# EAGLE design pi_rgb (EAGLE 7.1.0)
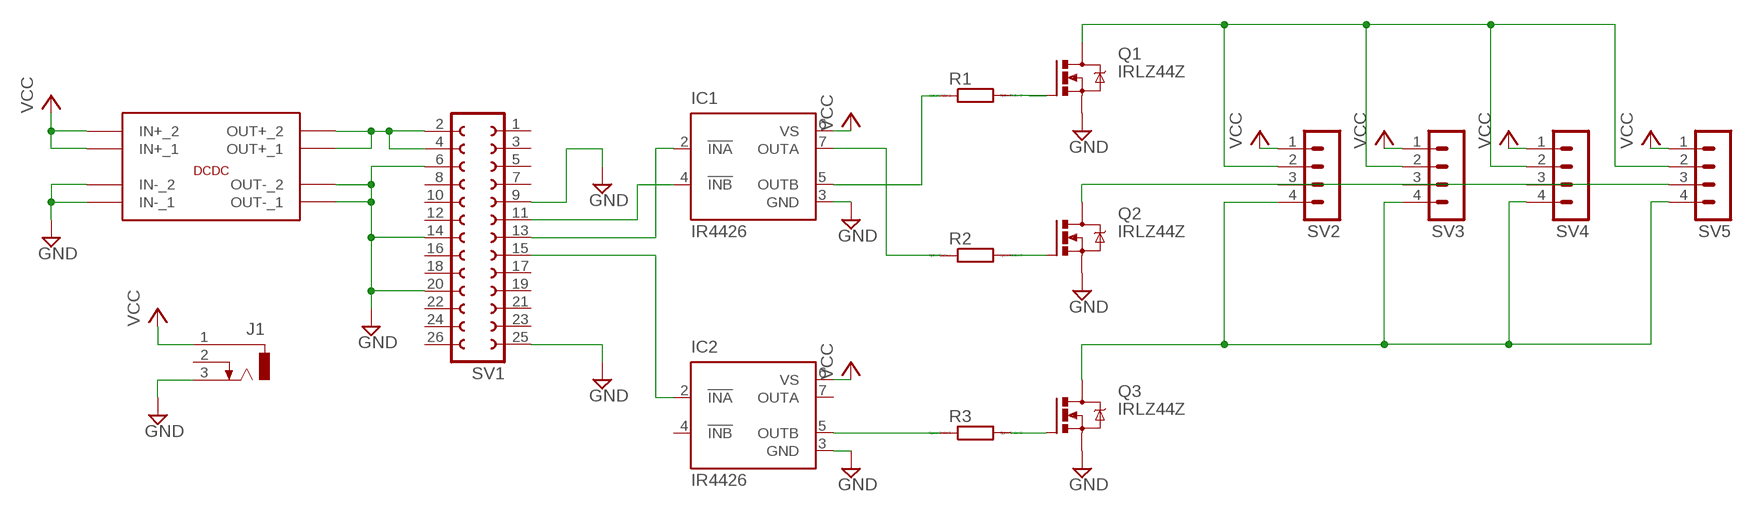
[diagram p0: schematic, sheet 1]

## Parts
5V  DCDC  [DCDC]
IC1  IR4426  [DIL08]
IC2  IR4426  [DIL08]
J1  DCJ0303  [DCJ0303]
Q1  IRLZ44Z  [TO220BV]
Q2  IRLZ44Z  [TO220BV]
Q3  IRLZ44Z  [TO220BV]
R1  R-EU_0204_5  [0204/5]
R2  R-EU_0204_5  [0204/5]
R3  R-EU_0204_5  [0204/5]
SV1  FE13-2  [FE13-2]
SV2  MA04-1  [MA04-1]
SV3  MA04-1  [MA04-1]
SV4  MA04-1  [MA04-1]
SV5  MA04-1  [MA04-1]

## Nets
GND: 5V.IN-_1 5V.IN-_2 5V.OUT-_1 5V.OUT-_2 IC1.3(GND) IC2.3(GND) J1.3 Q1.S Q2.S Q3.S SV1.6 SV1.9 SV1.14 SV1.20 SV1.25
N$1: IC1.4(!INB) SV1.11
N$2: IC1.2(!INA) SV1.13
N$3: IC2.2(!INA) SV1.15
N$4: Q2.G R2.2
N$5: Q3.G R3.2
N$6: IC2.5(OUTB) R3.1
N$7: Q2.D SV2.3 SV3.3 SV4.3 SV5.3
N$8: Q3.D SV2.4 SV3.4 SV4.4 SV5.4
N$9: 5V.OUT+2(OUT+_1) 5V.OUT+_1(OUT+_2) SV1.2 SV1.4
N$10: Q1.G R1.2
N$11: Q1.D SV2.2 SV3.2 SV4.2 SV5.2
N$12: IC1.7(OUTA) R2.1
N$13: IC1.5(OUTB) R1.1
VCC: 5V.IN+_1 5V.IN+_2 IC1.6(VS) IC2.6(VS) J1.1 SV2.1 SV3.1 SV4.1 SV5.1
Unconnected: IC2.4(!INB) IC2.7(OUTA) J1.2 SV1.1 SV1.3 SV1.5 SV1.7 SV1.8 SV1.10 SV1.12 SV1.16 SV1.17 SV1.18 SV1.19 SV1.21 SV1.22 SV1.23 SV1.24 SV1.26

## Library data of the parts
5V = DCDC:DCDC
IC1 IC2 = ir:IR4426: DUAL LOW SIDE DRIVER Source: ID4426.pdf; MF: INTERNATIONAL RECTIFIER(IR); MPN: IR4426PBF; OC_FARNELL: 1023265; OC_NEWARK: 19K8460
J1 = con-jack:DCJ0303: DC POWER JACK Source: DCJ0303.pdf; OC_FARNELL: unknown; OC_NEWARK: unknown
Q1-Q3 = transistor-power:IRLZ44Z: N-Channel HEXFET® Power MOSFET Logic Level AUTOMOTIVE MOSFET Source: http://www.irf.com/product-info/datasheets/data/irlz44zpbf.pdf
R1-R3 = resistor:R-EU_: RESISTOR, European symbol; SPICEPREFIX: R
SV1 = con-lsta:FE13-2: FEMALE HEADER; OC_FARNELL: unknown; OC_NEWARK: unknown
SV2-SV5 = con-lstb:MA04-1: PIN HEADER; OC_FARNELL: unknown; OC_NEWARK: unknown

## Board
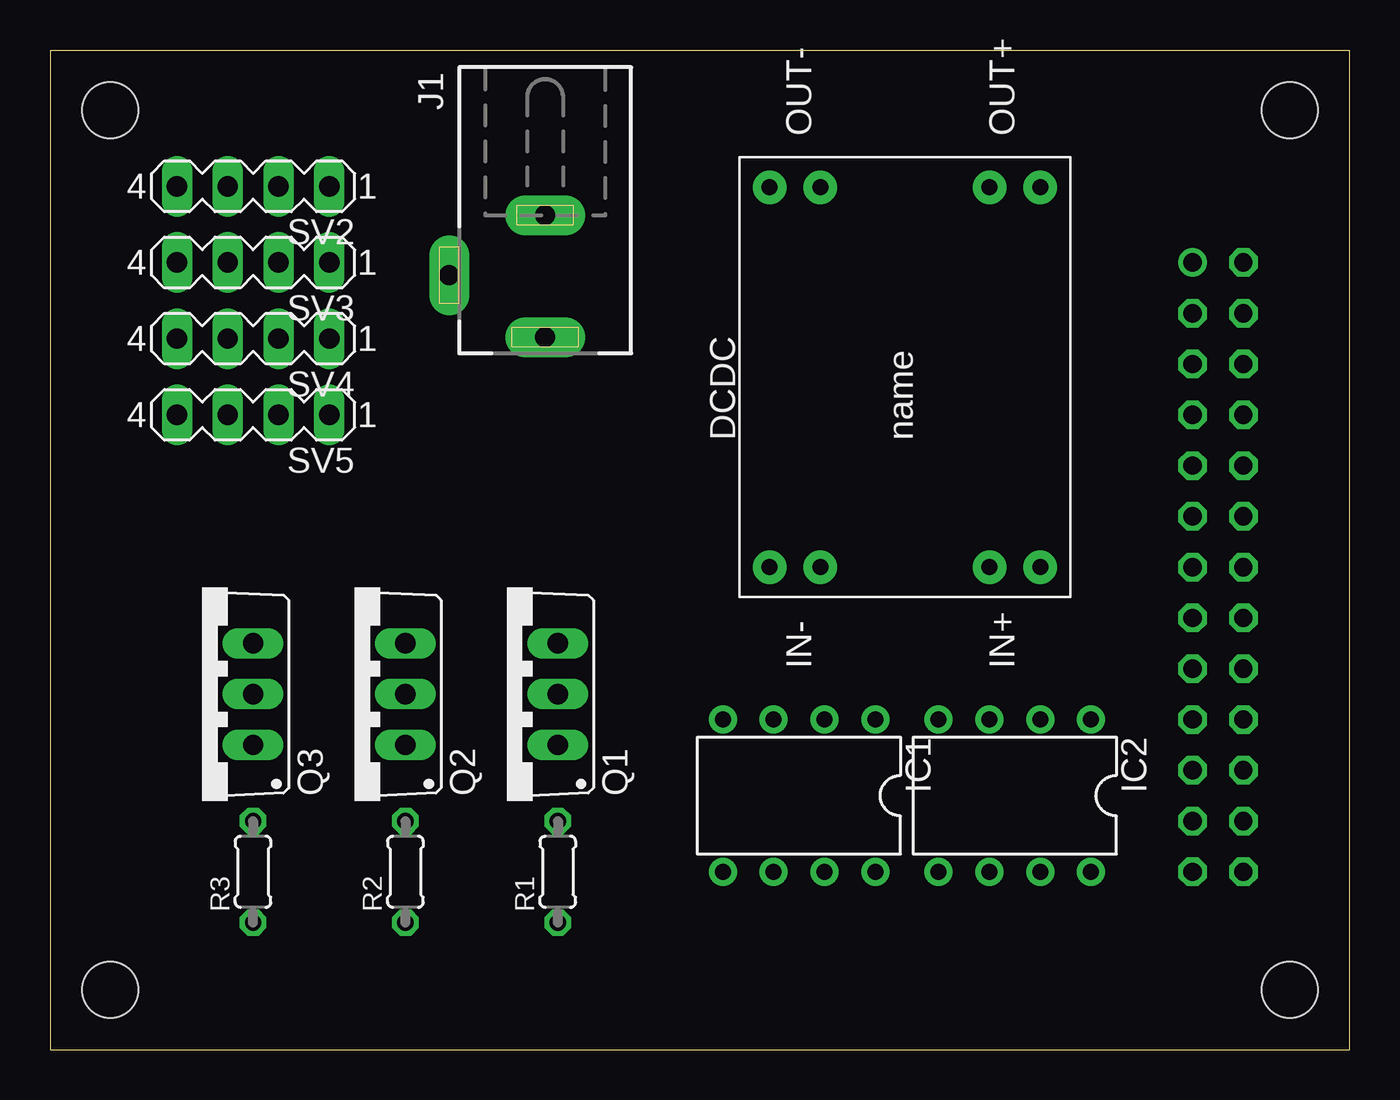
[diagram p1: board, top side]
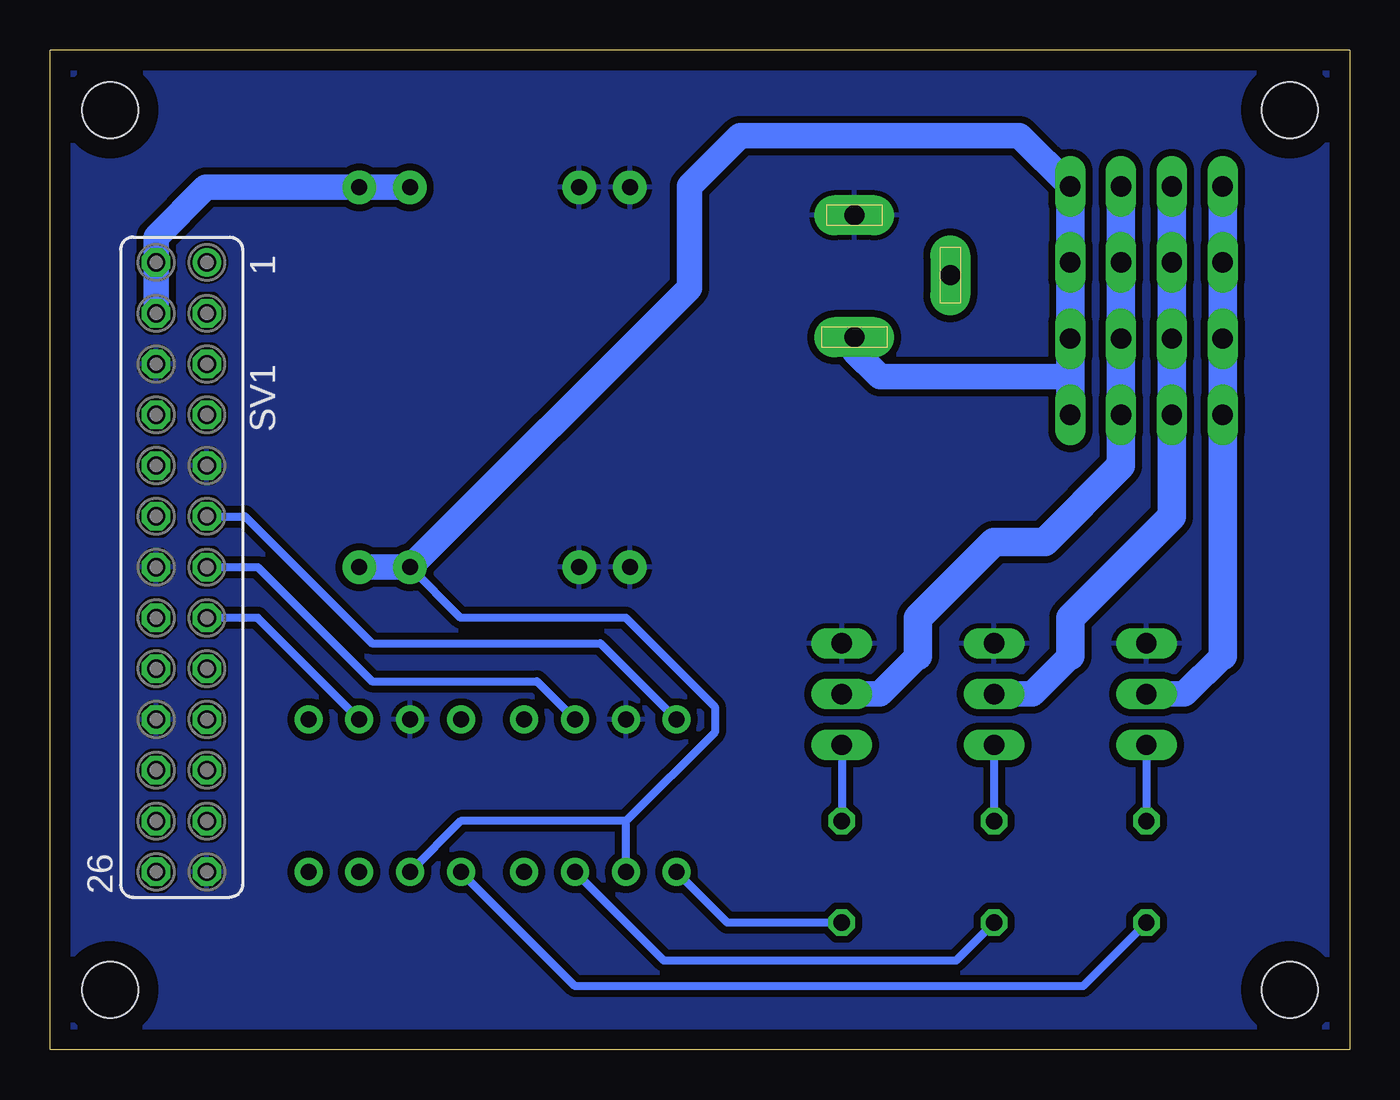
[diagram p2: board, bottom side, seen from below]

Size 65 x 50 mm. Coordinates in mm from the lower left corner, seen from the top.
Outline: 0,0 65,0 65,50 0,50 0,0
Copper layers (1*16): Top 0.035mm / dielectric 1.5mm / Bottom 0.035mm
Design rules "default": minimum track width 10mil, minimum drill 24mil, track to track 8mil, track to pad 8mil, pad to pad 8mil, via to via 8mil, smd to smd 8mil, copper to edge 40mil, drill to drill 8mil, minimum pad ring 10mil, minimum via ring 8mil, stop-mask expansion 4mil, vias tented up to drill 0mil, thermal gap 10mil
Holes 2.8 mm at 3,3 3,47 62,3 62,47

### Footprints (pad centres in the part's own frame; a part is rotated, then mirrored left to right if it is on the bottom)
DCDC = drill 0.8 pad 1.676: IN+_1 0,2.54; IN+_2 0,0; IN-_1 0,13.54; IN-_2 0,11; OUT+2 19,0; OUT+_1 19,2.54; OUT-_1 19,13.54; OUT-_2 19,11
DIL08 = drill 0.8 pad 1.4: 1 -3.81,-3.81; 2 -1.27,-3.81; 3 1.27,-3.81; 4 3.81,-3.81; 5 3.81,3.81; 6 1.27,3.81; 7 -1.27,3.81; 8 -3.81,3.81
DCJ0303 = drill 1 pad 2 long: 1 0,3.1; 2 4.8,0; 3 0,-3
TO220BV = drill 1.016 long: D 0,-2.54; G -2.54,-2.54; S 2.54,-2.54
0204/5 = drill 0.813 octagon: 1 -2.54,0; 2 2.54,0
FE13-2 = drill 0.914: 1 -15.24,1.27 | drill 0.914 octagon: 2 -15.24,-1.27; 3 -12.7,1.27; 4 -12.7,-1.27; 5 -10.16,1.27; 6 -10.16,-1.27; 7 -7.62,1.27; 8 -7.62,-1.27; 9 -5.08,1.27; 10 -5.08,-1.27; 11 -2.54,1.27; 12 -2.54,-1.27; 13 0,1.27; 14 0,-1.27; 15 2.54,1.27; 16 2.54,-1.27; 17 5.08,1.27; 18 5.08,-1.27; 19 7.62,1.27; 20 7.62,-1.27; 21 10.16,1.27; 22 10.16,-1.27; 23 12.7,1.27; 24 12.7,-1.27; 25 15.24,1.27; 26 15.24,-1.27
MA04-1 = drill 1.016 long: 1 -3.81,0; 2 -1.27,0; 3 1.27,0; 4 3.81,0

### Placement (x,y rotation side)
5V  49.53,24.13 90 top
IC1  37.47,12.7 180 top
IC2  48.26,12.7 180 top
J1  24.77,38.73 180 top
Q1  22.86,17.78 90 top
Q2  15.24,17.78 90 top
Q3  7.62,17.78 90 top
R1  25.4,8.89 90 top
R2  17.78,8.89 90 top
R3  10.16,8.89 90 top
SV1  58.42,24.13 270 bottom
SV2  10.16,43.18 180 top
SV3  10.16,39.37 180 top
SV4  10.16,35.56 180 top
SV5  10.16,31.75 180 top

### Tracks (layer width: path | path; a pad name or v marks a point on that pad's centre or on a via)
GND
  pour Bottom (isolate 1.27): 0,0 65,0 65,50 0,50
  pour Bottom (isolate 0.35): 0,0 64.68,0 65,0.32 65,50 0,49.68
N$1
  Bottom 0.406: SV1.11 55.24,26.67 48.9,20.32 37.47,20.32 IC1.4
N$2
  Bottom 0.406: SV1.13 54.61,24.13 48.9,18.41 40.64,18.41 IC1.2
N$3
  Bottom 0.406: IC2.2 54.61,21.59 SV1.15
N$4
  Bottom 0.406: Q2.G R2.2
N$5
  Bottom 0.406: Q3.G R3.2
N$6
  Bottom 0.406: R3.1 13.34,3.17 38.73,3.17 IC2.5
N$7
  Bottom 1.27: Q2.D 15.88,17.78 13.97,19.68
  Bottom 1.422: SV2.3 SV3.3 SV4.3 SV5.3 8.89,26.67 13.97,21.59 13.97,19.68
N$8
  Bottom 1.27: Q3.D 8.26,17.78 6.35,19.68
  Bottom 1.422: 6.35,19.68 SV5.4 SV4.4 SV3.4 SV2.4
N$9
  Bottom 1.27: SV1.4 SV1.2 59.69,40.64 57.2,43.13 5V.OUT+_1 5V.OUT+2
N$10
  Bottom 0.406: Q1.G R1.2
N$11
  Bottom 1.27: Q1.D 23.5,17.78 21.59,19.68
  Bottom 1.422: SV2.2 SV3.2 SV4.2 SV5.2 11.43,29.21 15.24,25.4 17.78,25.4 21.59,21.59 21.59,19.68
N$12
  Bottom 0.406: R2.1 19.68,4.45 34.29,4.45 IC1.7
N$13
  Bottom 0.406: R1.1 31.11,6.35 IC1.5
VCC
  Bottom 0.406: IC1.6 36.2,11.43 | 36.2,11.43 44.45,11.43 IC2.6 | 5V.IN+_1 44.45,21.59 36.2,21.59 31.75,17.14 31.75,15.88 36.2,11.43
  Bottom 1.27: 5V.IN+_2 5V.IN+_1 33.02,38.1 33.02,43.18 30.48,45.72 16.51,45.72 SV2.1 | 13.97,31.11 SV5.1 | J1.1 24.77,34.92 23.5,33.66 13.97,33.66
  Bottom 1.422: SV2.1 SV3.1 SV4.1 13.97,33.66 SV5.1